# EAGLE design Adafruit NeoPXL8 Wing (EAGLE 9.0.1)
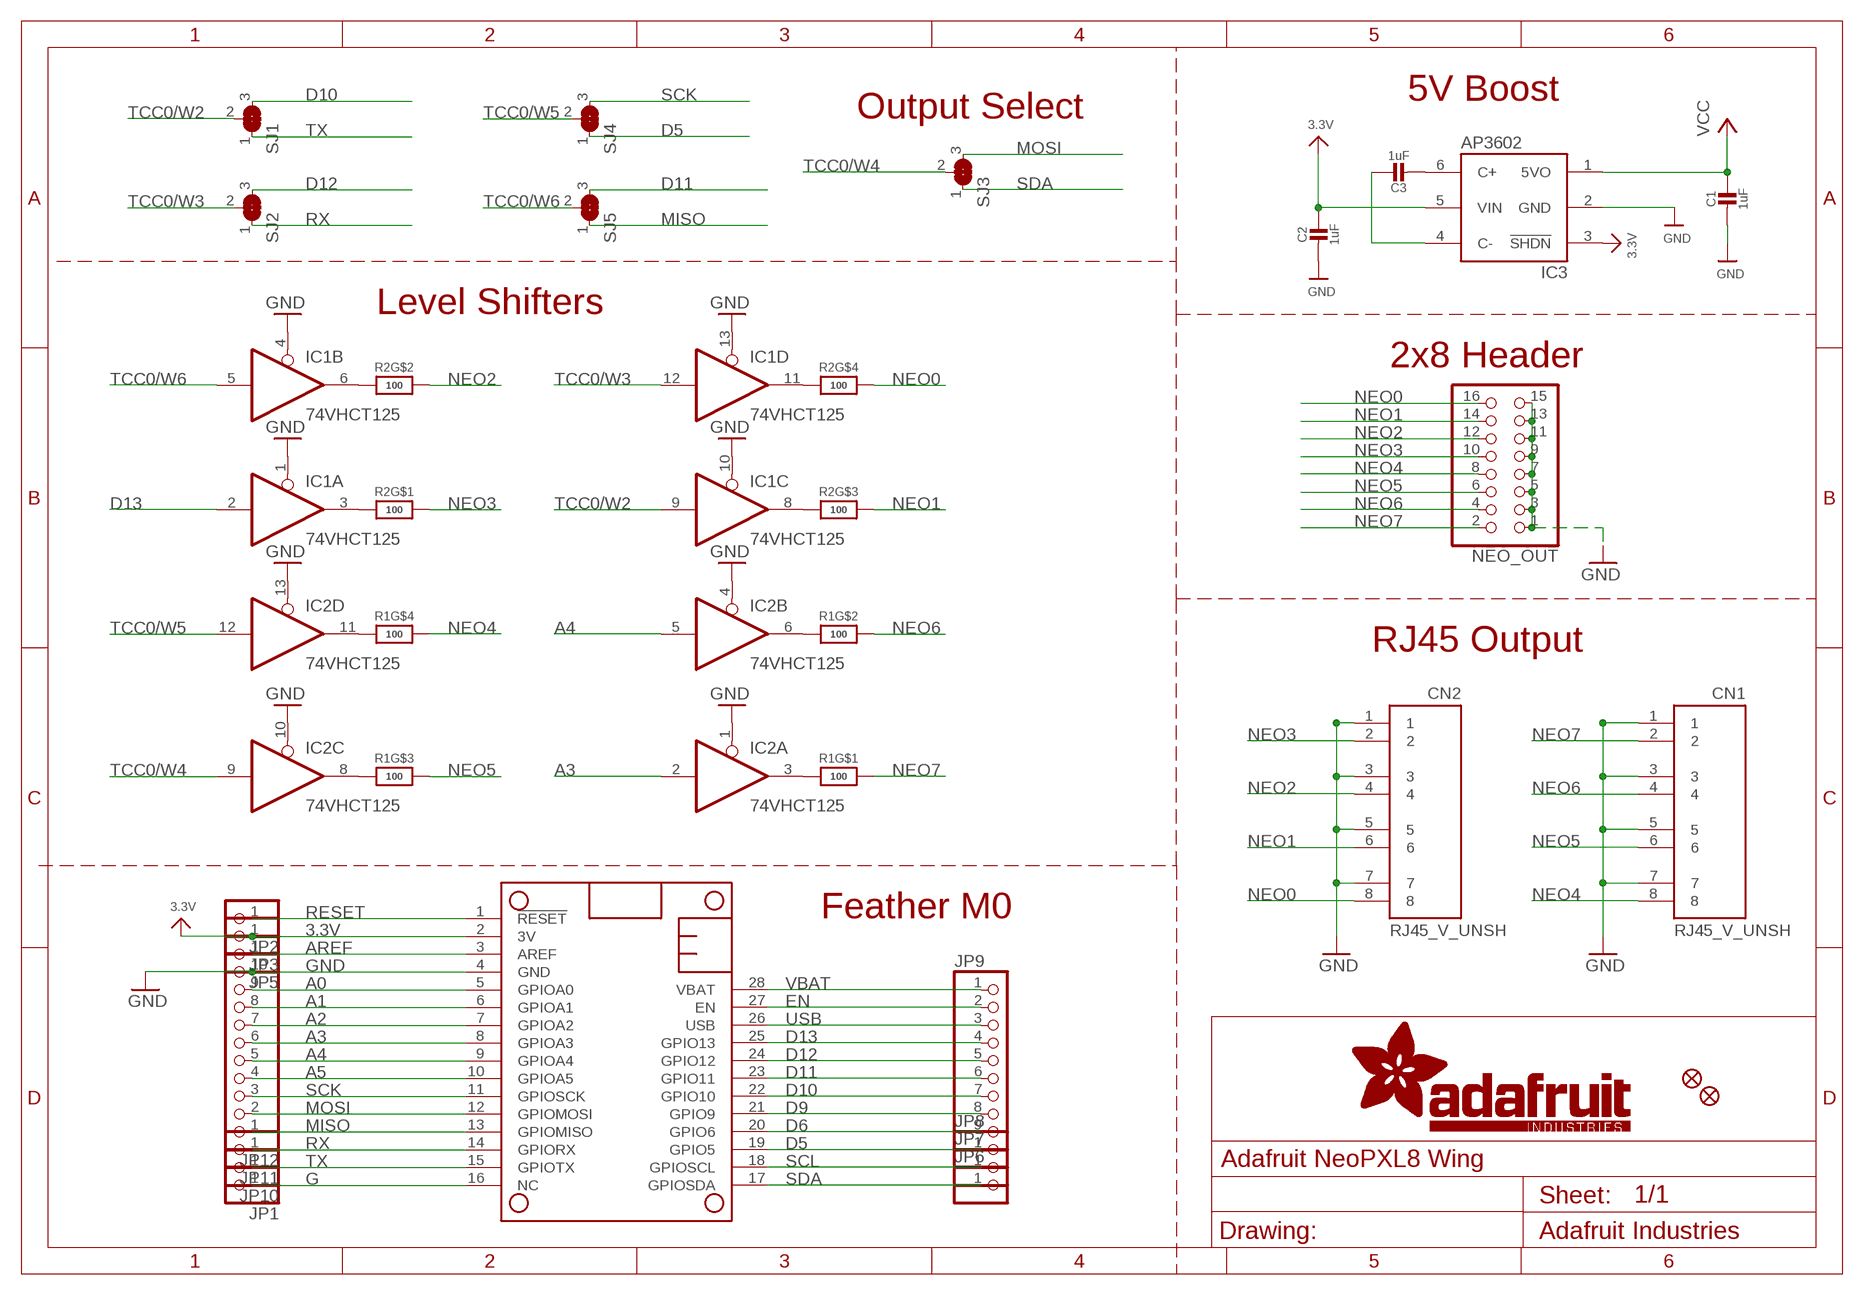
[diagram p0: schematic, sheet 1]

## Parts
C1  1uF  CAP_CERAMIC0603_NO  [0603-NO]
C2  1uF  CAP_CERAMIC0603_NO  [0603-NO]
C3  1uF  CAP_CERAMIC0603_NO  [0603-NO]
CN1  RJ45_V_UNSH  [RJ45_VERTICAL_UNSHIELDED]
CN2  RJ45_V_UNSH  [RJ45_VERTICAL_UNSHIELDED]
FID1  FIDUCIAL_1MM  [FIDUCIAL_1MM]
FID2  FIDUCIAL_1MM  [FIDUCIAL_1MM]
IC1  74VHCT125  74ABT125PW  [TSSOP14]
IC2  74VHCT125  74ABT125PW  [TSSOP14]
IC3  AP3602  [SOT23-6]
JP1  HEADER-1X1ROUND  [1X01_ROUND]
JP2  HEADER-1X1ROUND  [1X01_ROUND]
JP3  HEADER-1X1ROUND  [1X01_ROUND]
JP5  HEADER-1X1ROUND  [1X01_ROUND]
JP6  HEADER-1X1ROUND  [1X01_ROUND]
JP7  HEADER-1X1ROUND  [1X01_ROUND]
JP8  HEADER-1X1ROUND  [1X01_ROUND]
JP9  HEADER-1X970MIL  [1X09_ROUND_70]
JP10  HEADER-1X1ROUND  [1X01_ROUND]
JP11  HEADER-1X1ROUND  [1X01_ROUND]
JP12  HEADER-1X10ROUND  [1X10_ROUND]
MS1  FEATHERWING  [FEATHERWING]
NEO_OUT  HEADER-2X8  [2X08]
R1  100  RESISTOR_4PACK  [RESPACK_4X0603]
R2  100  RESISTOR_4PACK  [RESPACK_4X0603]
SJ1  SOLDERJUMPER_2WAY  [SOLDERJUMPER_2WAY_OPEN_NOPASTE]
SJ2  SOLDERJUMPER_2WAY  [SOLDERJUMPER_2WAY_OPEN_NOPASTE]
SJ3  SOLDERJUMPER_2WAY  [SOLDERJUMPER_2WAY_OPEN_NOPASTE]
SJ4  SOLDERJUMPER_2WAY  [SOLDERJUMPER_2WAY_OPEN_NOPASTE]
SJ5  SOLDERJUMPER_2WAY  [SOLDERJUMPER_2WAY_OPEN_NOPASTE]

## Nets
3.3V: C2.1 IC3.3(!SHDN) IC3.5(VIN) JP3.1 MS1.2(3V)
A0: JP12.9 MS1.5(GPIOA0)
A1: JP12.8 MS1.6(GPIOA1)
A2: JP12.7 MS1.7(GPIOA2)
A3: IC2.2(A:I) JP12.6 MS1.8(GPIOA3)
A4: IC2.5(B:I) JP12.5 MS1.9(GPIOA4)
A5: JP12.4 MS1.10(GPIOA5)
AREF: JP5.1 MS1.3(AREF)
D5: JP8.1 MS1.19(GPIO5) SJ4.1
D6: JP9.9 MS1.20(GPIO6)
D9: JP9.8 MS1.21(GPIO9)
D10: JP9.7 MS1.22(GPIO10) SJ1.3
D11: JP9.6 MS1.23(GPIO11) SJ5.3
D12: JP9.5 MS1.24(GPIO12) SJ2.3
D13: IC1.2(A:I) JP9.4 MS1.25(GPIO13)
EN: JP9.2 MS1.27(EN)
G: JP1.1 MS1.16(NC)
GND: C1.2 C2.2 CN1.1 CN1.3 CN1.5 CN1.7 CN2.1 CN2.3 CN2.5 CN2.7 IC1.1(A:OE) IC1.4(B:OE) IC1.10(C:OE) IC1.13(D:OE) IC2.1(A:OE) IC2.4(B:OE) IC2.10(C:OE) IC2.13(D:OE) IC3.2(GND) JP12.10 MS1.4(GND) NEO_OUT.1 NEO_OUT.3 NEO_OUT.5 NEO_OUT.7 NEO_OUT.9 NEO_OUT.11 NEO_OUT.13 NEO_OUT.15
MISO: JP12.1 MS1.13(GPIOMISO) SJ5.1
MOSI: JP12.2 MS1.12(GPIOMOSI) SJ3.3
N$1: IC2.3(A:O) R1.1
N$2: IC1.11(D:O) R2.4
N$3: IC1.8(C:O) R2.3
N$4: IC1.6(B:O) R2.2
N$5: IC1.3(A:O) R2.1
N$6: IC2.6(B:O) R1.2
N$7: IC2.8(C:O) R1.3
N$8: IC2.11(D:O) R1.4
N$14: C3.2 IC3.6(C+)
N$15: C3.1 IC3.4(C-)
NEO0: CN2.8 NEO_OUT.16 R2.5
NEO1: CN2.6 NEO_OUT.14 R2.6
NEO2: CN2.4 NEO_OUT.12 R2.7
NEO3: CN2.2 NEO_OUT.10 R2.8
NEO4: CN1.8 NEO_OUT.8 R1.5
NEO5: CN1.6 NEO_OUT.6 R1.6
NEO6: CN1.4 NEO_OUT.4 R1.7
NEO7: CN1.2 NEO_OUT.2 R1.8
RESET: JP2.1 MS1.1(!RESET)
RX: JP11.1 MS1.14(GPIORX) SJ2.1
SCK: JP12.3 MS1.11(GPIOSCK) SJ4.3
SCL: JP7.1 MS1.18(GPIOSCL)
SDA: JP6.1 MS1.17(GPIOSDA) SJ3.1
TCC0/W2: IC1.9(C:I) SJ1.2
TCC0/W3: IC1.12(D:I) SJ2.2
TCC0/W4: IC2.9(C:I) SJ3.2
TCC0/W5: IC2.12(D:I) SJ4.2
TCC0/W6: IC1.5(B:I) SJ5.2
TX: JP10.1 MS1.15(GPIOTX) SJ1.1
USB: JP9.3 MS1.26(USB)
VBAT: JP9.1 MS1.28(VBAT)
VCC: C1.1 IC3.1(5VO)

## Notes on the sheet
- 5V Boost
- Output Select
- Level Shifters
- 2x8 Header
- RJ45 Output
- Feather M0

## Power pins joined to a net without a drawn wire
GND: IC1.7(P:GND) IC2.7(P:GND)
VCC: IC1.14(P:VCC) IC2.14(P:VCC)

## Library data of the parts
C1-C3 = microbuilder:CAP_CERAMIC: Ceramic Capacitors For new designs, use the packages preceded by an '_' character since they are more reliable: The following footprints should be used on most boards: _0402 - Standard footprint for regular board layouts _0603 - Standard footprint for regular board layouts _0805 - Standard footprint for regular board layouts _1206 - Standard footprint for regular board layouts For extremely tight-pitch boards where space is at a premium, the following 'micro-pitch' footprints can be used (smaller pads, no silkscreen outline, etc.): _0402MP - Micro-pitch footprint for very dense/compact boards _0603MP - Micro-pitch footprint for very dense/compact boards _0805MP - Micro-pitch footprint for very dense/compact boards _1206MP - Micro-pitch footprint for very dense/compact boards
CN1 CN2 = microbuilder:RJ45
FID1 FID2 = microbuilder:FIDUCIAL: Fiducial Alignment Points Various fiducial points for machine vision alignment.; BOM: EXCLUDE
IC1 IC2 = 74xx-eu:74*125: Quad bus BUFFER, 3-state
IC3 = microbuilder:AP3602
JP1-JP3 JP5-JP8 JP10 JP11 = microbuilder:HEADER-1X1: PIN HEADER
JP9 = microbuilder:HEADER-1X9: PIN HEADER
JP12 = microbuilder:HEADER-1X10: PIN HEADER
MS1 = microbuilder:FEATHERWING
NEO_OUT = microbuilder:HEADER-2X8
R1 R2 = microbuilder:RESISTOR_4PACK: Resistor Packs (4 resistors) 4 x 0603 10K 1/16W - Digikey: YC164J-10KCT-ND
SJ1-SJ5 = microbuilder:SOLDERJUMPER_2WAY: 2-Way Solder Jumper

## Board
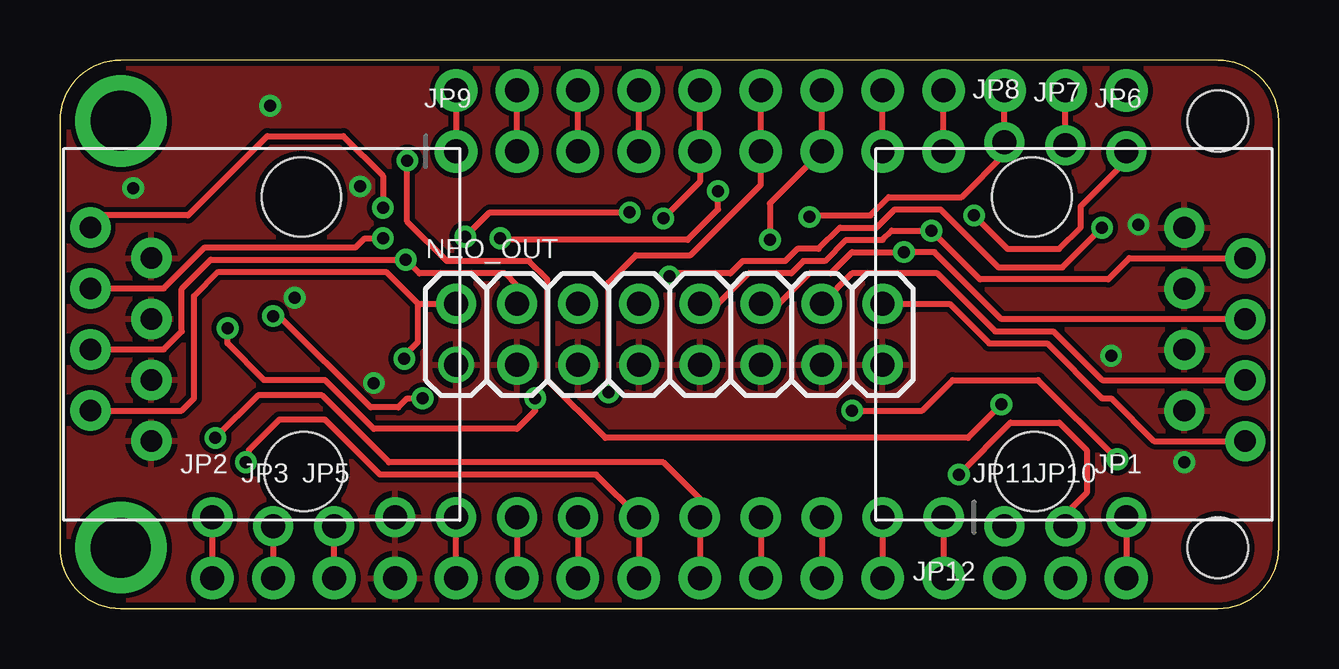
[diagram p1: board, top side]
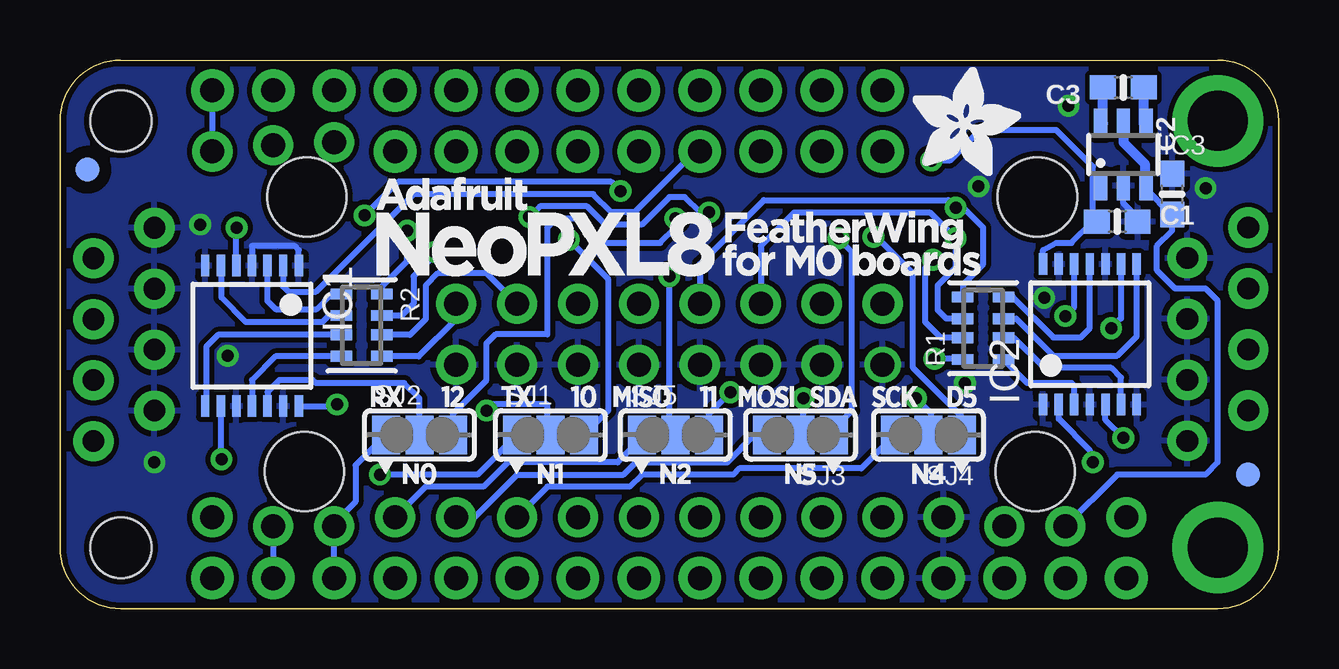
[diagram p2: board, bottom side, seen from below]

Size 50.8 x 22.86 mm. Coordinates in mm from the lower left corner, seen from the top.
Outline: 48.26,22.86 arc-90 50.8,20.32 50.8,2.54 arc-90 48.26,0 2.54,0 arc-90 0,2.54 0,20.32 arc-90 2.54,22.86
Copper layers (1*16): Top 0.035mm / dielectric 1.5mm / Bottom 0.035mm
Design rules "adafruit *": minimum track width 8mil, minimum drill 15.5mil, track to track 8mil, track to pad 8mil, pad to pad 8mil, via to via 8mil, smd to smd 8mil, copper to edge 10mil, drill to drill 8mil, minimum pad ring 10mil, minimum via ring 8mil, stop-mask expansion 2mil, vias tented up to drill 20mil, thermal gap 10mil

### Footprints (pad centres in the part's own frame; a part is rotated, then mirrored left to right if it is on the bottom)
0603-NO = smd 1.075 x 1: 1 -0.85,0; 2 0.85,0
RJ45_VERTICAL_UNSHIELDED = drill 0.9 pad 1.676: 1 -4.44,6.35; 2 -3.17,8.89; 3 -1.9,6.35; 4 -0.63,8.89; 5 0.64,6.35; 6 1.91,8.89; 7 3.18,6.35; 8 4.45,8.89 | hole 3.302: -5.715,0; 5.715,0.1
FIDUCIAL_1MM = smd 1 x 1: 1 0,0
TSSOP14 = smd 0.35 x 0.9: 1 -1.95,-2.925; 2 -1.3,-2.925; 3 -0.65,-2.925; 4 0,-2.925; 5 0.65,-2.925; 6 1.3,-2.925; 7 1.95,-2.925; 8 1.95,2.925; 9 1.3,2.925; 10 0.65,2.925; 11 0,2.925; 12 -0.65,2.925; 13 -1.3,2.925; 14 -1.95,2.925
SOT23-6 = smd 0.55 x 1.2: 1 -0.95,-1.3; 2 0,-1.3; 3 0.95,-1.3; 4 0.95,1.3; 5 0,1.3; 6 -0.95,1.3
1X01_ROUND = drill 1 pad 1.676: 1 0,0
1X09_ROUND_70 = drill 1 pad 1.778: 1 -10.16,0; 2 -7.62,0; 3 -5.08,0; 4 -2.54,0; 5 0,0; 6 2.54,0; 7 5.08,0; 8 7.62,0; 9 10.16,0
1X10_ROUND = drill 1 pad 1.676: 1 -11.43,0; 2 -8.89,0; 3 -6.35,0; 4 -3.81,0; 5 -1.27,0; 6 1.27,0; 7 3.81,0; 8 6.35,0; 9 8.89,0; 10 11.43,0
FEATHERWING = drill 1 pad 1.778: 1 6.35,1.27; 2 8.89,1.27; 3 11.43,1.27; 4 13.97,1.27; 5 16.51,1.27; 6 19.05,1.27; 7 21.59,1.27; 8 24.13,1.27; 9 26.67,1.27; 10 29.21,1.27; 11 31.75,1.27; 12 34.29,1.27; 13 36.83,1.27; 14 39.37,1.27; 15 41.91,1.27; 16 44.45,1.27; 17 44.45,21.59; 18 41.91,21.59; 19 39.37,21.59; 20 36.83,21.59; 21 34.29,21.59; 22 31.75,21.59; 23 29.21,21.59; 24 26.67,21.59; 25 24.13,21.59; 26 21.59,21.59; 27 19.05,21.59; 28 16.51,21.59 | drill 2.5 pad 3.81: P$1 2.54,20.32; P$2 2.54,2.54 | hole 2.54: 48.26,20.32; 48.26,2.54
2X08 = drill 1: 1 -8.89,-1.27 | drill 1 pad 1.676: 2 -8.89,1.27; 3 -6.35,-1.27; 4 -6.35,1.27; 5 -3.81,-1.27; 6 -3.81,1.27; 7 -1.27,-1.27; 8 -1.27,1.27; 9 1.27,-1.27; 10 1.27,1.27; 11 3.81,-1.27; 12 3.81,1.27; 13 6.35,-1.27; 14 6.35,1.27; 15 8.89,-1.27; 16 8.89,1.27
RESPACK_4X0603 = smd 0.45 x 0.9: 1 -1.3,-0.85; 2 -0.4,-0.85; 3 0.4,-0.85; 4 1.3,-0.85; 5 1.3,0.85; 6 0.4,0.85; 7 -0.4,0.85; 8 -1.3,0.85
SOLDERJUMPER_2WAY_OPEN_NOPASTE = smd 1.168 x 1.6: 1 -1.397,0; 2 0,0; 3 1.397,0

### Placement (x,y rotation side)
C1  6.73,16.13 0 bottom
C2  4.45,17.27 90 bottom
C3  6.48,21.72 180 bottom
CN1  10.16,11.43 90 top
CN2  40.51,11.43 270 top
FID1  1.27,5.59 0 bottom
FID2  49.66,18.29 0 bottom
IC1  42.8,11.37 180 bottom
IC2  7.87,11.43 0 bottom
IC3  6.48,18.92 0 bottom
JP1  44.45,3.81 0 top
JP2  6.35,3.81 0 top
JP3  8.89,3.43 0 top
JP5  11.43,3.43 0 top
JP6  44.45,19.05 0 top
JP7  41.91,19.3 0 top
JP8  39.37,19.43 0 top
JP9  26.67,19.05 0 top
JP10  41.91,3.43 0 top
JP11  39.37,3.43 0 top
JP12  25.4,3.81 180 top
MS1  0,0 0 top
NEO_OUT  25.4,11.43 0 top
R1  12.32,11.68 90 bottom
R2  38.23,11.81 270 bottom
SJ1  30.35,7.24 0 bottom
SJ2  35.81,7.24 0 bottom
SJ3  19.94,7.24 180 bottom
SJ4  14.61,7.24 180 bottom
SJ5  25.15,7.24 0 bottom
U$7  [NEOPXL8_TOP]  0,0 0 top
U$8  [NEOPXL8_BOT]  50.8,0 0 bottom

### Tracks (layer width: path | path; a pad name or v marks a point on that pad's centre or on a via)
3.3V
  Top 0.254: JP3.1 MS1.2
  Bottom 0.254: JP3.1 6.73,5.59 3.05,5.59 2.54,6.1 2.54,12.83 3.05,13.34 4.32,13.34 5.08,14.1 5.08,15.11 4.45,15.75 C2.1 4.48,16.42 5.53,17.46 IC3.3
  Bottom 0.406: IC3.5 6.48,19.43 5.59,18.54 5.59,17.68 IC3.3
A0
  Top 0.254: MS1.5 JP12.9
A1
  Top 0.254: JP12.8 MS1.6
A2
  Top 0.254: JP12.7 MS1.7
A3  (via drill 0.5)
  Top 0.254: MS1.8 JP12.6 22.35,5.59 13.34,5.59 11.05,7.87 9.14,7.87 7.87,6.6 7.87,6.22 v7.75,6.1
  Bottom 0.254: IC2.2 9.17,7.9 7.87,6.6 7.87,6.22 v7.75,6.1
A4  (via drill 0.5)
  Top 0.254: MS1.9 JP12.5 26.67,4.57 25.15,6.1 13.72,6.1 10.92,8.89 8.26,8.89 v6.48,7.11
  Bottom 0.254: IC2.5 7.22,7.86 v6.48,7.11
A5
  Top 0.254: JP12.4 MS1.10
AREF
  Top 0.254: MS1.3 JP5.1
D5  (via drill 0.5)
  Top 0.254: MS1.19 JP8.1 39.37,18.92 37.59,17.14 34.54,17.14 33.78,16.38 31.3,16.38 v31.24,16.32 | v23.75,16.51 17.91,16.51 v16.89,15.49
  Bottom 0.254: SJ4.1 13.21,8 15.24,10.03 15.24,13.97 16.76,15.49 v16.89,15.49 | v23.75,16.51 24.13,16.51 24.77,17.14 25.4,17.14 26.54,16 28.07,16 28.83,16.76 30.8,16.76 v31.24,16.32
D6
  Top 0.254: JP9.9 MS1.20
D9
  Top 0.254: JP9.8 MS1.21
D10  (via drill 0.5)
  Top 0.254: MS1.22 JP9.7 29.59,16.89 v29.59,15.37
  Bottom 0.254: SJ1.3 27.94,8.26 27.94,13.72 v29.59,15.37
D11  (via drill 0.5)
  Top 0.254: MS1.23 JP9.6 29.21,17.65 26.29,14.73 24,14.73 22.86,13.59 v22.86,9.02
  Bottom 0.254: SJ5.3 23.75,8.13 v22.86,9.02
D12  (via drill 0.5)
  Top 0.254: MS1.24 JP9.5 26.67,17.78 v25.15,16.26
  Bottom 0.254: SJ2.3 34.42,8.13 33.02,9.53 33.02,11.05 32.64,11.43 30.48,11.43 30.48,15.88 30.1,16.26 29.21,16.26 28.19,15.24 25.78,15.24 25.15,15.88 v25.15,16.26
D13
  Top 0.254: JP9.4 MS1.25
  Bottom 0.254: IC1.2 41.5,13.43 41.27,13.21 40.13,13.21 36.07,17.27 28.57,17.27 27.81,16.51 26.86,16.51 24.32,19.05 JP9.4
EN
  Top 0.254: JP9.2 MS1.27
G
  Top 0.254: JP1.1 MS1.16
GND  (via drill 0.5)
  Bottom 0.254: IC1.1 40.85,14.94 41.02,15.11 42.8,15.11 IC1.4 | C1.2 5.71,16.13 6.48,16.89 IC3.2
  other vias: 44.96,16 43.81,10.54 9.78,12.95 46.86,6.1 13.08,9.4 8.76,20.95 3.05,17.53 12.51,17.59
  pour Bottom: 0,22.86 0,0 50.8,0 50.8,22.86
  pour Top: 0,22.86 0,0 50.8,0 50.8,22.86
MISO
  Top 0.254: JP12.1 MS1.13
  Bottom 0.254: JP12.1 35.56,5.08 33.15,5.08 32.13,6.1 27.56,6.1 26.54,7.11 SJ5.1
MOSI
  Top 0.254: JP12.2 MS1.12
  Bottom 0.254: JP12.2 33.53,3.81 31.75,5.59 27.3,5.59 26.8,6.1 22.99,6.1 21.84,7.24 SJ3.3
N$1
  Bottom 0.254: IC2.3 8.52,9.29 8.64,9.4 10.48,9.4 R1.1
N$2
  Bottom 0.254: R2.4 41.81,10.51 42.8,9.53 IC1.11
N$3
  Bottom 0.254: R2.3 44.22,11.41 44.7,10.92 44.7,8.49 IC1.8
N$4
  Bottom 0.254: R2.2 39.6,12.21 39.88,11.94 43.05,11.94 44.07,12.95 44.07,14.26 IC1.6
N$5
  Bottom 0.254: R2.1 39.47,13.11 40.1,12.48 41.81,12.48 42.16,12.83 42.15,12.84 IC1.3
N$6
  Bottom 0.254: IC2.6 6.57,9.62 6.99,10.03 9.78,10.03 11.03,11.28 R1.2
N$7
  Bottom 0.254: R1.3 10.94,12.08 9.4,10.54 6.73,10.54 5.92,11.35 IC2.8 5.97,14.31
N$8
  Bottom 0.254: R1.4 11.08,12.98 9.4,11.3 8.26,11.3 7.87,11.68 IC2.11
N$9
  Bottom 0.254: 36.32,7.24 36.7,7.24
N$10
  Bottom 0.254: 13.72,7.24 14.1,7.24
N$11
  Bottom 0.254: 19.05,7.24 19.43,7.24
N$12
  Bottom 0.254: 25.65,7.24 26.16,7.24
N$13
  Bottom 0.254: 30.86,7.24 31.24,7.24
N$14
  Bottom 0.406: IC3.6 7.33,20.22 C3.2
N$15
  Bottom 0.406: IC3.4 5.63,20.22 C3.1
NEO0
  Top 0.254: NEO_OUT.16 37.08,12.7 38.73,11.05 41.15,11.05 43.43,8.76 43.81,8.76 45.6,6.98 CN2.8 48.9,6.48
  Bottom 0.254: NEO_OUT.16 34.29,12.06 35.84,10.51 R2.5
NEO1
  Top 0.254: CN2.6 43.44,9.52 41.4,11.56 38.99,11.56 36.58,13.97 33.02,13.97 NEO_OUT.14
  Bottom 0.254: NEO_OUT.14 33.02,13.97 35.05,13.97 35.56,13.46 35.56,12.06 36.21,11.41 R2.6
NEO2  (via drill 0.5)
  Top 0.254: CN2.4 39.25,12.06 36.45,14.86 v35.18,14.86 33.02,14.86 32.13,13.97 31.24,13.97 29.97,12.7 NEO_OUT.12
  Bottom 0.254: R2.7 36.56,12.21 36.07,12.7 36.07,13.84 35.18,14.73 v35.18,14.86
NEO3  (via drill 0.5)
  Top 0.254: NEO_OUT.10 26.8,12.57 27.3,12.57 28.7,13.97 30.48,13.97 30.99,14.48 31.88,14.48 32.77,15.37 34.29,15.37 34.67,15.75 v36.32,15.75 38.35,13.72 43.69,13.72 44.57,14.6 CN2.2
  Bottom 0.254: R2.8 37.38,13.42 36.32,14.48 v36.32,15.75
NEO4  (via drill 0.5)
  Top 0.254: CN1.8 1.78,16.38 5.33,16.38 8.64,19.68 11.81,19.68 13.46,18.03 v13.46,16.7
  Bottom 0.254: NEO_OUT.8 24.13,14.35 21.46,17.02 13.78,17.02 v13.46,16.7 13.14,16.7 12.32,15.88 12.32,14.35 13.17,13.5 R1.5
NEO5  (via drill 0.5)
  Top 0.254: CN1.6 4.32,13.34 6.03,15.05 12.32,15.05 12.7,15.43 v13.46,15.43
  Bottom 0.254: R1.6 13.86,12.08 14.22,12.45 14.22,13.46 13.46,14.22 v13.46,15.43 14.54,16.51 20.19,16.51 21.59,15.11 NEO_OUT.6
NEO6  (via drill 0.5)
  Top 0.254: CN1.4 4.32,10.8 5.08,11.56 5.08,13.34 6.29,14.54 v14.41,14.54 14.99,13.97 18.54,13.97 19.05,13.46 NEO_OUT.4
  Bottom 0.254: R1.7 14.08,11.28 14.73,11.94 14.73,14.22 v14.41,14.54
NEO7  (via drill 0.5)
  Top 0.254: CN1.2 5.08,8.26 5.59,8.76 5.59,13.02 6.6,14.03 13.59,14.03 14.92,12.7 | 14.35,10.29 v14.35,10.41 14.35,10.54 14.92,11.11 14.92,12.7 | 14.92,12.7 NEO_OUT.2
  Bottom 0.254: R1.8 13.2,10.41 v14.35,10.41
RESET
  Top 0.254: JP2.1 MS1.1
RX
  Bottom 0.254: 39.37,3.81 39.37,3.56 | MS1.14 JP11.1 39.37,3.56 | SJ2.1 38.48,5.97 38.48,4.45 39.37,3.56
SCK
  Top 0.254: JP12.3 MS1.11
  Bottom 0.254: SJ4.3 17.4,5.84 22.48,5.84 22.73,5.59 26.54,5.59 27.05,5.08 30.48,5.08 JP12.3
SCL
  Top 0.254: JP7.1 MS1.18
SDA  (via drill 0.5)
  Top 0.254: v27.43,17.4 27.43,16.64 26.16,15.37 18.29,15.37 v18.35,15.43 | v38.1,16.38 39.5,14.99 41.66,14.99 42.55,15.88 42.55,16.76 44.45,18.67 JP6.1
  Bottom 0.254: 18.54,7.62 SJ3.1 18.54,7.49 17.78,8.26 17.78,14.86 v18.35,15.43 | MS1.17 JP6.1 | v27.43,17.4 27.81,17.78 36.7,17.78 v38.1,16.38
TCC0/W2  (via drill 0.5)
  Top 0.254: v33.02,8.26 35.94,8.26 37.21,9.53 40.77,9.53 v44.07,6.22
  Bottom 0.254: SJ1.2 30.48,7.37 30.48,8.51 32.77,8.51 v33.02,8.26 | IC1.9 44.1,6.25 v44.07,6.22
TCC0/W3
  Bottom 0.254: SJ2.2 35.81,8.76 36.45,9.4 40.13,9.4 40.26,9.53 41.66,9.53 42.15,9.03 IC1.12
TCC0/W4  (via drill 0.5)
  Top 0.254: v6.99,11.68 6.99,11.05 8.51,9.53 11.05,9.53 13.08,7.49 19.05,7.49 19.81,8.26 v19.81,8.76
  Bottom 0.254: SJ3.2 19.81,7.37 v19.81,8.76 | IC2.9 6.57,12.1 v6.99,11.68
TCC0/W5  (via drill 0.5)
  Top 0.254: v8.89,12.19 9.14,12.19 12.95,8.38 14.1,8.38 14.48,8.76 v15.11,8.76
  Bottom 0.254: SJ4.2 14.48,7.37 14.48,8.13 v15.11,8.76 | v8.89,12.19 8.52,12.56 IC2.12
TCC0/W6  (via drill 0.5)
  Top 0.254: v25.4,13.84 25.53,13.97 27.94,13.97 28.45,14.48 30.23,14.48 30.73,14.99 31.62,14.99 32.51,15.88 34.04,15.88 34.8,16.64 36.7,16.64 39.12,14.22 41.78,14.22 v43.43,15.88
  Bottom 0.254: SJ5.2 25.4,7.49 v25.4,13.84 | IC1.5 43.45,15.86 v43.43,15.88
TX  (via drill 0.5)
  Top 0.254: v37.47,5.59 39.62,7.75 41.66,7.75 42.8,6.6 42.8,4.83 41.91,3.94 JP10.1
  Bottom 0.254: SJ1.1 33.4,5.59 v37.47,5.59 | JP10.1 MS1.15
USB
  Top 0.254: JP9.3 MS1.26
VBAT
  Top 0.254: MS1.28 JP9.1
VCC  (via drill 0.5)
  Top 0.254: v39.24,8.51 37.85,7.11 22.73,7.11 20.32,9.53 20.32,13.72 19.56,14.48 16.13,14.48 14.48,16.13 v14.48,18.67
  Bottom 0.254: IC2.14 9.82,14.94 9.27,15.24 8.64,15.24 7.75,16.13 | 7.75,16.13 7.75,17.65 | 7.75,17.65 7.75,18.41 9.27,19.94 12.45,19.94 13.72,18.67 v14.48,18.67 | IC3.1 7.72,17.62 7.75,17.65 | C1.1 7.75,16.13 | IC1.14 39.31,8.44 v39.24,8.51